# Altium schematic sheet Power.SchDoc
size A4; SheetNumber: 2; SheetTotal: 10
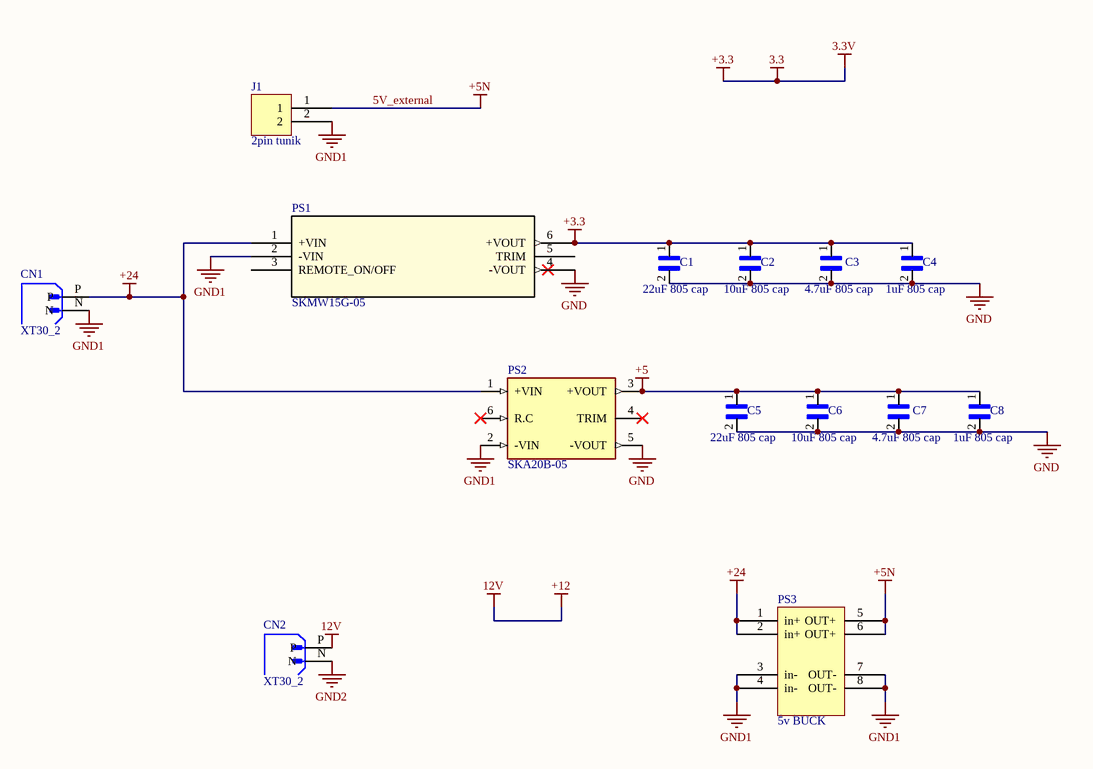
[diagram p0: Power.SchDoc]

## Parts
C1  22uF 805 cap  [1uF 805 Cap]
C2  10uF 805 cap  [1uF 805 Cap]
C3  4.7uF 805 cap  [1uF 805 Cap]
C4  1uF 805 cap  [1uF 805 Cap]
C5  22uF 805 cap  [1uF 805 Cap]
C6  10uF 805 cap  [1uF 805 Cap]
C7  4.7uF 805 cap  [1uF 805 Cap]
C8  1uF 805 cap  [1uF 805 Cap]
CN1  XT30_2  [XT30_2]
CN2  XT30_2  [XT30_2]
J1  2pin tunik  [2pin tunşk]
PS1  SKMW15G-05  [SKMW15DKMW15_MWU]
PS2  SKA20B-05  [CONV_SKA20B-05]
PS3  5v BUCK  [5V Buck Conv]

## Nets
5V_external: J1.1 PS3.5(OUT+) PS3.6(OUT+)  [also labelled +5N]
+3.3: C1.1 C2.1 C3.1 C4.1 PS1.6(+VOUT)  [also labelled 3.3, 3.3V]
+5: C5.1 C6.1 C7.1 C8.1 PS2.3(+VOUT)
+12: CN2.P  [also labelled 12V]
+24: CN1.P PS1.1(+VIN) PS2.1(+VIN) PS3.1(in+) PS3.2(in+)
GND: C1.2 C2.2 C3.2 C4.2 C5.2 C6.2 C7.2 C8.2 PS1.4(-VOUT) PS2.5(-VOUT)
GND1: CN1.N J1.2 PS1.2(-VIN) PS2.2(-VIN) PS3.3(in-) PS3.4(in-) PS3.7(OUT-) PS3.8(OUT-)
GND2: CN2.N

Not connected (* = marked no-connect by the designer): PS1 3(REMOTE_ON/OFF) 5(TRIM); PS2 4(TRIM)* 6(R.C)*

## Library data of the parts
C1-C3 C5-C7 = 1uF 805 cap
PS1 = SKMW15G-03_1: No Description Available; Manufacturer_Name: Mean Well; Copyright: Copyright (C) 2025 Ultra Librarian. All rights reserved.; Manufacturer_Part_Number: SKMW15G-05; RefDes: RefDes; Type: Type
PS2 = SKA20B-05: Isolated Module DC DC Converter 1 Output 5V 4A 18V - 36V Input; Package: None; Price: None; Value: *; MP: SKA20B-05; Availability: Unavailable